# EAGLE design lineterm (EAGLE 6.2)
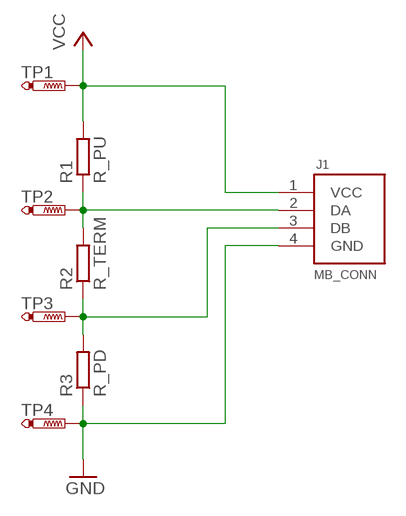
[diagram p0: schematic, sheet 1]

## Parts
J1  MB_CONN  [PTSM0,5/4-HH-2,5-THR]
R1  R_PU  R-EU_0207/12  [0207/12]
R2  R_TERM  R-EU_0207/12  [0207/12]
R3  R_PD  R-EU_0207/12  [0207/12]
TP1  PTR1TP15R  [TP15R]
TP2  PTR1TP15R  [TP15R]
TP3  PTR1TP15R  [TP15R]
TP4  PTR1TP15R  [TP15R]

## Nets
GND: J1.4(GND) R3.1 TP4.TP
N$2: J1.3(DB) R2.1 R3.2 TP3.TP
N$3: J1.2(DA) R1.1 R2.2 TP2.TP
VCC: J1.1(VCC) R1.2 TP1.TP

## Library data of the parts
J1 = connectors-pheonix:MB_CONN: Datasheet: Link <http://docs-europe.electrocomponents.com/webdocs/0ecc/0900766b80ecc30f.pdf> RS Stock No:712-4500 <http://uk.rs-online.com/web/p/terminal-blocks/7124500/> Mfr Part: PTSM 0,5/ 4-HH-2,5-THR
R1-R3 = resistor:R-EU_: RESISTOR, European symbol
TP1-TP4 = testpad:PTR1: TEST PIN

## Board
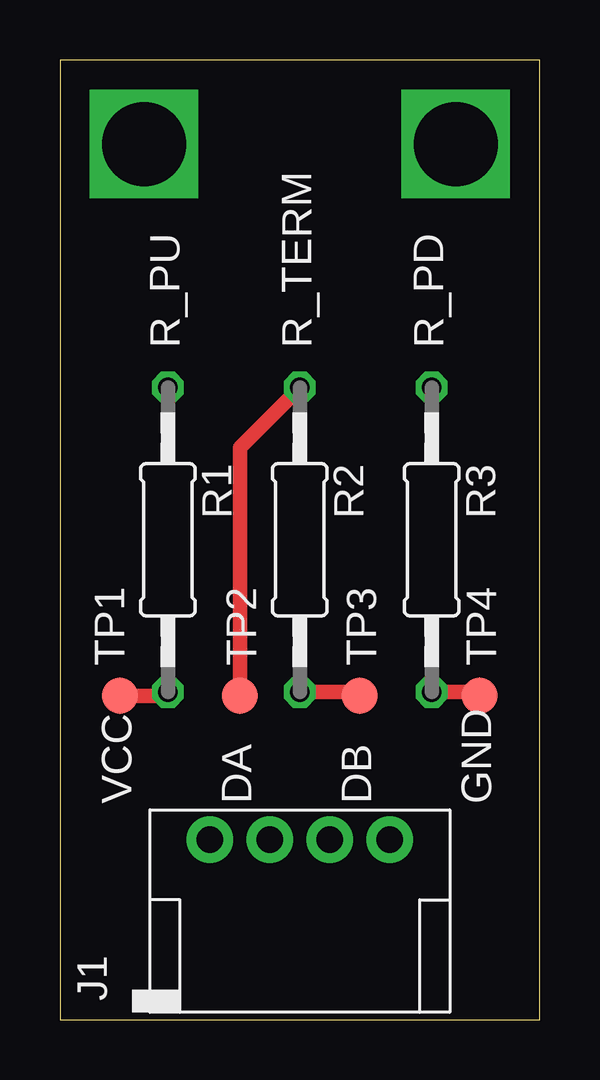
[diagram p1: board, top side]
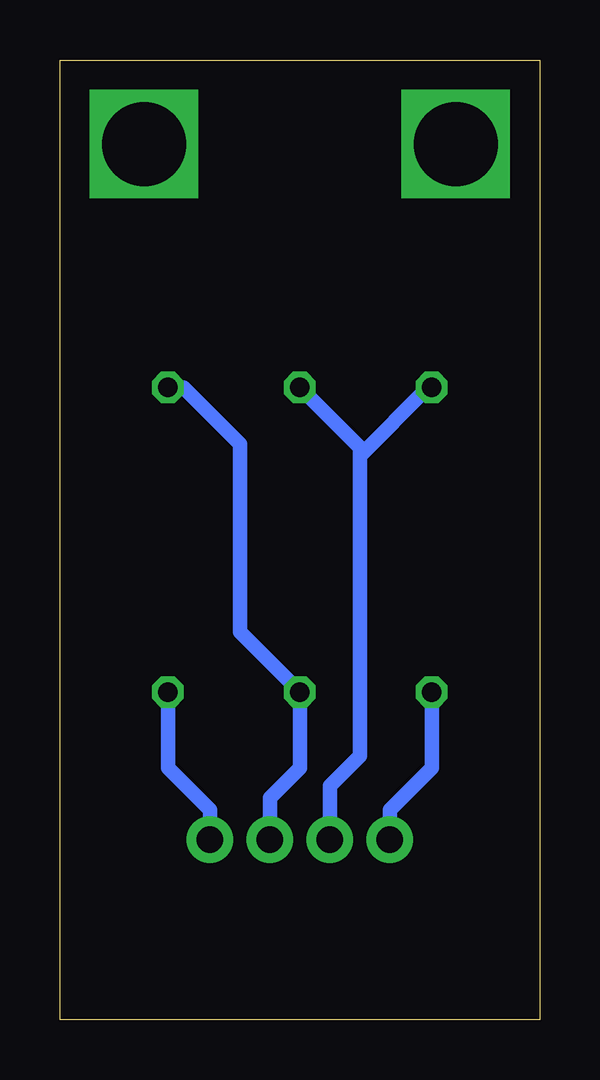
[diagram p2: board, bottom side, seen from below]

Size 20 x 40 mm. Coordinates in mm from the lower left corner, seen from the top.
Outline: 0,0 20,0 20,40 0,40 0,0
Copper layers (1*16): Top 0.035mm / dielectric 1.5mm / Bottom 0.035mm
Design rules: minimum track width 10mil, minimum drill 24mil, track to track 8mil, track to pad 8mil, pad to pad 8mil, via to via 8mil, smd to smd 8mil, copper to edge 40mil, drill to drill 8mil, minimum pad ring 10mil, minimum via ring 8mil, stop-mask expansion 4mil, vias tented up to drill 0mil, thermal gap 10mil

### Footprints (pad centres in the part's own frame; a part is rotated, then mirrored left to right if it is on the bottom)
PTSM0,5/4-HH-2,5-THR = drill 1.1 pad 1.93: 1 -3.75,0; 2 -1.25,0; 3 1.25,0; 4 3.75,0
0207/12 = drill 0.813 octagon: 1 -6.35,0; 2 6.35,0
TP15R = smd 1.5 x 1.5: TP 0,0

### Placement (x,y rotation side)
J1  10,7.5 0 top
R1  4.5,20 270 top
R2  10,20 90 top
R3  15.5,20 90 top
TP1  2.5,13.5 0 top
TP2  7.5,13.5 0 top
TP3  12.5,13.5 0 top
TP4  17.5,13.5 0 top

### Tracks (layer width: path | path; a pad name or v marks a point on that pad's centre or on a via)
GND
  Top 0.61: R3.1 17.35,13.65 TP4.TP
  Bottom 0.61: J1.4 13.75,8.75 15.5,10.5 R3.1
N$1  (via drill 3.5 pad 3.81)
  other vias: 3.5,36.5
N$2
  Top 0.61: R2.1 12.35,13.65 TP3.TP
  Bottom 0.61: J1.3 11.25,9.25 10,10.5 R2.1 12.5,16.15 12.5,24 14.85,26.35 R3.2
N$3
  Top 0.61: TP2.TP 7.5,23.85 R2.2
  Bottom 0.61: J1.2 8.75,9.75 7.5,11 7.5,23.5 | 7.5,23.5 7.5,23.85 R2.2 | R1.1 4.65,26.35 7.5,23.5
N$4  (via drill 3.5 pad 3.81)
  other vias: 16.5,36.5
VCC
  Top 0.61: TP1.TP 4.35,13.5 R1.2
  Bottom 0.61: J1.1 6.25,8.75 4.5,10.5 R1.2

### Text on the board
tNames: R_PU | R_TERM | R_PD | VCC | DA | DB | GND